# Altium schematic sheet [02] - Sheet Connector.SchDoc: =ProjectName
size A4; CheckedBy: Ven; Author: Ven; CompanyName: HUST; Revision: V.1.0
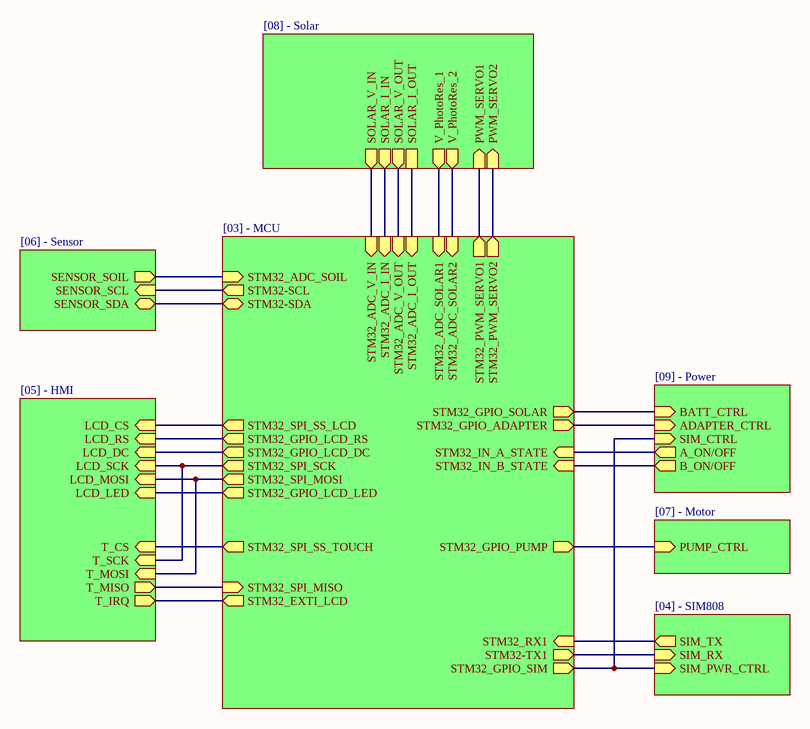
[diagram p0: [02] - Sheet Connector.SchDoc]

## Sub-sheets
01 = [03] - MCU: STM32-SDA (bidir), STM32_GPIO_SOLAR (out), STM32_SPI_MISO (in), STM32_EXTI_LCD (out), STM32_ADC_SOLAR1 (in), STM32_ADC_SOIL (in), STM32_GPIO_LCD_LED (out), STM32_SPI_SS_TOUCH (out), STM32_IN_B_STATE (in), STM32_ADC_I_IN (in), STM32_GPIO_PUMP (out), STM32_ADC_V_IN (in), STM32_ADC_SOLAR2 (in), STM32_GPIO_LCD_RS (out), STM32-TX1 (out), STM32_GPIO_LCD_DC (out), STM32_GPIO_ADAPTER (out), STM32_ADC_I_OUT (in), STM32_SPI_SS_LCD (out), STM32_RX1 (in), STM32_IN_A_STATE (in), STM32_SPI_MOSI (out), STM32_SPI_SCK (out), STM32-SCL (out), STM32_ADC_V_OUT (in), STM32_PWM_SERVO2 (out), STM32_PWM_SERVO1 (out), STM32_GPIO_SIM (out)
02 = [04] - SIM808: SIM_TX (out), SIM_RX (in), SIM_PWR_CTRL (in)
03 = [05] - HMI: T_SCK (in), LCD_MOSI (in), LCD_DC (in), T_MOSI (in), T_IRQ (out), T_MISO (out), LCD_LED (in), LCD_SCK (in), LCD_CS (in), T_CS (in), LCD_RS (in)
04 = [06] - Sensor: SENSOR_SCL (in), SENSOR_SDA (bidir), SENSOR_SOIL (out)
05 = [07] - Motor: PUMP_CTRL (in)
06 = [08] - Solar: SOLAR_V_OUT (out), SOLAR_I_OUT, SOLAR_V_IN (out), SOLAR_I_IN (out), PWM_SERVO2 (in), PWM_SERVO1 (in), V_PhotoRes_1 (out), V_PhotoRes_2 (out)
07 = [09] - Power: A_ON/OFF (out), BATT_CTRL (in), SIM_CTRL (in), ADAPTER_CTRL (in), B_ON/OFF (out)

## Nets
(unnamed): sheet 01/STM32-SDA, sheet 04/SENSOR_SDA
(unnamed): sheet 01/STM32_GPIO_SOLAR, sheet 07/BATT_CTRL
(unnamed): sheet 01/STM32_SPI_MISO, sheet 03/T_MISO
(unnamed): sheet 01/STM32_EXTI_LCD, sheet 03/T_IRQ
(unnamed): sheet 01/STM32_ADC_SOLAR1, sheet 06/V_PhotoRes_1
(unnamed): sheet 01/STM32_ADC_SOIL, sheet 04/SENSOR_SOIL
(unnamed): sheet 01/STM32_GPIO_LCD_LED, sheet 03/LCD_LED
(unnamed): sheet 01/STM32_SPI_SS_TOUCH, sheet 03/T_CS
(unnamed): sheet 01/STM32_IN_B_STATE, sheet 07/B_ON/OFF
(unnamed): sheet 01/STM32_ADC_I_IN, sheet 06/SOLAR_I_IN
(unnamed): sheet 01/STM32_GPIO_PUMP, sheet 05/PUMP_CTRL
(unnamed): sheet 01/STM32_ADC_V_IN, sheet 06/SOLAR_V_IN
(unnamed): sheet 01/STM32_ADC_SOLAR2, sheet 06/V_PhotoRes_2
(unnamed): sheet 01/STM32_GPIO_LCD_RS, sheet 03/LCD_RS
(unnamed): sheet 01/STM32-TX1, sheet 02/SIM_RX
(unnamed): sheet 01/STM32_GPIO_LCD_DC, sheet 03/LCD_DC
(unnamed): sheet 01/STM32_GPIO_ADAPTER, sheet 07/ADAPTER_CTRL
(unnamed): sheet 01/STM32_ADC_I_OUT, sheet 06/SOLAR_I_OUT
(unnamed): sheet 01/STM32_SPI_SS_LCD, sheet 03/LCD_CS
(unnamed): sheet 01/STM32_RX1, sheet 02/SIM_TX
(unnamed): sheet 01/STM32_IN_A_STATE, sheet 07/A_ON/OFF
(unnamed): sheet 01/STM32_SPI_MOSI, sheet 03/LCD_MOSI, sheet 03/T_MOSI
(unnamed): sheet 01/STM32_SPI_SCK, sheet 03/T_SCK, sheet 03/LCD_SCK
(unnamed): sheet 01/STM32-SCL, sheet 04/SENSOR_SCL
(unnamed): sheet 01/STM32_ADC_V_OUT, sheet 06/SOLAR_V_OUT
(unnamed): sheet 01/STM32_PWM_SERVO2, sheet 06/PWM_SERVO2
(unnamed): sheet 01/STM32_PWM_SERVO1, sheet 06/PWM_SERVO1
(unnamed): sheet 01/STM32_GPIO_SIM, sheet 02/SIM_PWR_CTRL, sheet 07/SIM_CTRL

## Notes on the sheet
- Project:
- Page Contents:
- Size:
- Date:
- A4
- Checked by:
- Time:
- Revision:
- Sheet
- of
- File: